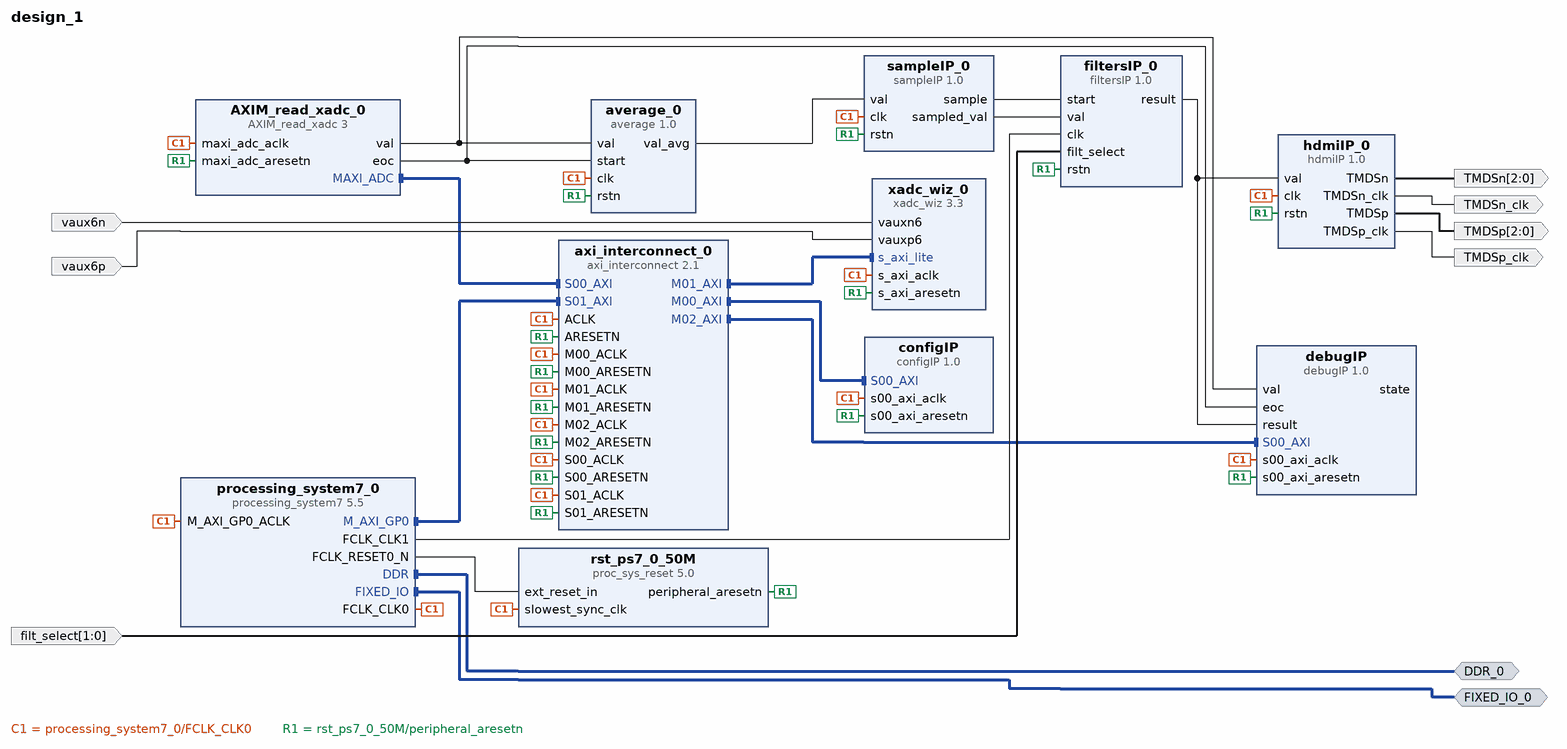
[diagram p0: block diagram of the top level]
# Vivado block design design_1, xc7z010clg400-1, Vivado 2019.2
create_bd_design design_1

create_bd_intf_port -mode Master -vlnv xilinx.com:interface:ddrx_rtl:1.0 DDR_0
create_bd_intf_port -mode Master -vlnv xilinx.com:display_processing_system7:fixedio_rtl:1.0 FIXED_IO_0
create_bd_port -dir I vaux6n
create_bd_port -dir I vaux6p
create_bd_port -dir I -from 1 -to 0 filt_select
create_bd_port -dir O -from 2 -to 0 TMDSn
create_bd_port -dir O -type clk TMDSn_clk
create_bd_port -dir O -from 2 -to 0 TMDSp
create_bd_port -dir O -type clk TMDSp_clk

create_bd_cell -type ip -vlnv xilinx.com:ip:xadc_wiz:3.3 xadc_wiz_0
set_property -dict [list \
  CONFIG.CHANNEL_ENABLE_VP_VN false \
  CONFIG.ENABLE_VCCDDRO_ALARM false \
  CONFIG.ENABLE_VCCPAUX_ALARM false \
  CONFIG.ENABLE_VCCPINT_ALARM false \
  CONFIG.EXTERNAL_MUX_CHANNEL VP_VN \
  CONFIG.OT_ALARM false \
  CONFIG.SEQUENCER_MODE Off \
  CONFIG.SINGLE_CHANNEL_ACQUISITION_TIME false \
  CONFIG.SINGLE_CHANNEL_SELECTION VAUXP6_VAUXN6 \
  CONFIG.USER_TEMP_ALARM false \
  CONFIG.VCCAUX_ALARM false \
  CONFIG.VCCINT_ALARM false \
  CONFIG.WAVEFORM_TYPE CONSTANT \
  CONFIG.XADC_STARUP_SELECTION single_channel \
] [get_bd_cells xadc_wiz_0]
create_bd_cell -type ip -vlnv xilinx.com:ip:axi_interconnect:2.1 axi_interconnect_0
set_property -dict {CONFIG.NUM_MI 3 CONFIG.NUM_SI 2} [get_bd_cells axi_interconnect_0]
create_bd_cell -type ip -vlnv xilinx.com:ip:proc_sys_reset:5.0 rst_ps7_0_50M
create_bd_cell -type ip -vlnv xilinx.com:ip:processing_system7:5.5 processing_system7_0
set_property -dict [list \
  CONFIG.PCW_APU_PERIPHERAL_FREQMHZ 667 \
  CONFIG.PCW_ENET0_ENET0_IO {MIO 16 .. 27} \
  CONFIG.PCW_ENET0_GRP_MDIO_ENABLE 1 \
  CONFIG.PCW_ENET0_GRP_MDIO_IO {MIO 52 .. 53} \
  CONFIG.PCW_ENET0_PERIPHERAL_ENABLE 1 \
  CONFIG.PCW_ENET0_RESET_ENABLE 0 \
  CONFIG.PCW_ENET_RESET_ENABLE 1 \
  CONFIG.PCW_ENET_RESET_SELECT {Share reset pin} \
  CONFIG.PCW_EN_CLK1_PORT 1 \
  CONFIG.PCW_FCLK_CLK1_BUF TRUE \
  CONFIG.PCW_FPGA1_PERIPHERAL_FREQMHZ 100 \
  CONFIG.PCW_FPGA_FCLK1_ENABLE 1 \
  CONFIG.PCW_GPIO_MIO_GPIO_ENABLE 1 \
  CONFIG.PCW_GPIO_MIO_GPIO_IO MIO \
  CONFIG.PCW_I2C_RESET_ENABLE 0 \
  CONFIG.PCW_PRESET_BANK1_VOLTAGE {LVCMOS 1.8V} \
  CONFIG.PCW_QSPI_GRP_FBCLK_ENABLE 1 \
  CONFIG.PCW_QSPI_GRP_FBCLK_IO {MIO 8} \
  CONFIG.PCW_QSPI_GRP_SINGLE_SS_ENABLE 1 \
  CONFIG.PCW_QSPI_GRP_SINGLE_SS_IO {MIO 1 .. 6} \
  CONFIG.PCW_QSPI_PERIPHERAL_ENABLE 1 \
  CONFIG.PCW_QSPI_QSPI_IO {MIO 1 .. 6} \
  CONFIG.PCW_SD0_GRP_CD_ENABLE 1 \
  CONFIG.PCW_SD0_GRP_CD_IO {MIO 47} \
  CONFIG.PCW_SD0_GRP_WP_ENABLE 0 \
  CONFIG.PCW_SD0_PERIPHERAL_ENABLE 1 \
  CONFIG.PCW_SD0_SD0_IO {MIO 40 .. 45} \
  CONFIG.PCW_SDIO_PERIPHERAL_FREQMHZ 50 \
  CONFIG.PCW_SINGLE_QSPI_DATA_MODE x4 \
  CONFIG.PCW_UART1_PERIPHERAL_ENABLE 1 \
  CONFIG.PCW_UART1_UART1_IO {MIO 48 .. 49} \
  CONFIG.PCW_UART_PERIPHERAL_FREQMHZ 100 \
  CONFIG.PCW_UIPARAM_DDR_FREQ_MHZ 533.333333 \
  CONFIG.PCW_UIPARAM_DDR_MEMORY_TYPE {DDR 3 (Low Voltage)} \
  CONFIG.PCW_UIPARAM_DDR_PARTNO {MT41K256M16 RE-125} \
  CONFIG.PCW_USB0_PERIPHERAL_ENABLE 1 \
  CONFIG.PCW_USB0_RESET_ENABLE 1 \
  CONFIG.PCW_USB0_RESET_IO {MIO 46} \
  CONFIG.PCW_USB0_USB0_IO {MIO 28 .. 39} \
  CONFIG.PCW_USB_RESET_ENABLE 1 \
  CONFIG.PCW_USB_RESET_SELECT {Share reset pin} \
] [get_bd_cells processing_system7_0]
# 296 more settings of processing_system7_0 are not shown: defaults, MIO pin electricals, DDR timing, and values the tool derives
create_bd_cell -type ip -vlnv user.org:user:debugIP:1.0 debugIP
create_bd_cell -type ip -vlnv user.org:user:AXIM_read_xadc:3 AXIM_read_xadc_0
set_property -dict {CONFIG.DEBUG_PARAM 0} [get_bd_cells AXIM_read_xadc_0]
create_bd_cell -type ip -vlnv user.org:user:configIP:1.0 configIP
set_property -dict {CONFIG.DEBUG_PARAM 0} [get_bd_cells configIP]
create_bd_cell -type ip -vlnv user.org:user:average:1.0 average_0
create_bd_cell -type ip -vlnv user.org:user:hdmiIP:1.0 hdmiIP_0
create_bd_cell -type ip -vlnv user.org:user:sampleIP:1.0 sampleIP_0
create_bd_cell -type ip -vlnv user.org:user:filtersIP:1.0 filtersIP_0
set_property -dict {CONFIG.M 23 CONFIG.XANT_ADDR_SIZE 5 CONFIG.XCOEF_ADDR_SIZE 5} [get_bd_cells filtersIP_0]

# ---- connections ----

connect_bd_intf_net [get_bd_intf_pins processing_system7_0/M_AXI_GP0] [get_bd_intf_pins axi_interconnect_0/S01_AXI]
connect_bd_intf_net [get_bd_intf_pins xadc_wiz_0/s_axi_lite] [get_bd_intf_pins axi_interconnect_0/M01_AXI]
connect_bd_intf_net [get_bd_intf_pins configIP/S00_AXI] [get_bd_intf_pins axi_interconnect_0/M00_AXI]
connect_bd_intf_net [get_bd_intf_pins AXIM_read_xadc_0/MAXI_ADC] [get_bd_intf_pins axi_interconnect_0/S00_AXI]
connect_bd_intf_net [get_bd_intf_pins debugIP/S00_AXI] [get_bd_intf_pins axi_interconnect_0/M02_AXI]
connect_bd_intf_net [get_bd_intf_ports DDR_0] [get_bd_intf_pins processing_system7_0/DDR]
connect_bd_intf_net [get_bd_intf_ports FIXED_IO_0] [get_bd_intf_pins processing_system7_0/FIXED_IO]
connect_bd_net -net vauxn6_1 [get_bd_ports vaux6n] [get_bd_pins xadc_wiz_0/vauxn6]
connect_bd_net -net vauxp6_1 [get_bd_ports vaux6p] [get_bd_pins xadc_wiz_0/vauxp6]
connect_bd_net [get_bd_pins AXIM_read_xadc_0/val] [get_bd_pins debugIP/val] [get_bd_pins average_0/val]
connect_bd_net -net clk_wiz_0_clk [get_bd_pins processing_system7_0/FCLK_CLK0] \
  [get_bd_pins axi_interconnect_0/ACLK] [get_bd_pins axi_interconnect_0/S00_ACLK] [get_bd_pins axi_interconnect_0/M00_ACLK] \
  [get_bd_pins axi_interconnect_0/M01_ACLK] [get_bd_pins axi_interconnect_0/S01_ACLK] \
  [get_bd_pins axi_interconnect_0/M02_ACLK] [get_bd_pins xadc_wiz_0/s_axi_aclk] \
  [get_bd_pins processing_system7_0/M_AXI_GP0_ACLK] [get_bd_pins rst_ps7_0_50M/slowest_sync_clk] \
  [get_bd_pins debugIP/s00_axi_aclk] [get_bd_pins AXIM_read_xadc_0/maxi_adc_aclk] [get_bd_pins configIP/s00_axi_aclk] \
  [get_bd_pins average_0/clk] [get_bd_pins hdmiIP_0/clk] [get_bd_pins sampleIP_0/clk]
connect_bd_net [get_bd_pins rst_ps7_0_50M/peripheral_aresetn] \
  [get_bd_pins xadc_wiz_0/s_axi_aresetn] [get_bd_pins axi_interconnect_0/M02_ARESETN] \
  [get_bd_pins axi_interconnect_0/S01_ARESETN] [get_bd_pins axi_interconnect_0/M01_ARESETN] \
  [get_bd_pins axi_interconnect_0/M00_ARESETN] [get_bd_pins axi_interconnect_0/S00_ARESETN] \
  [get_bd_pins axi_interconnect_0/ARESETN] [get_bd_pins debugIP/s00_axi_aresetn] \
  [get_bd_pins AXIM_read_xadc_0/maxi_adc_aresetn] [get_bd_pins configIP/s00_axi_aresetn] [get_bd_pins average_0/rstn] \
  [get_bd_pins hdmiIP_0/rstn] [get_bd_pins sampleIP_0/rstn] [get_bd_pins filtersIP_0/rstn]
connect_bd_net [get_bd_pins AXIM_read_xadc_0/eoc] [get_bd_pins debugIP/eoc] [get_bd_pins average_0/start]
# net AXIM_read_xadc_0_mst_exec_state has one end: debugIP/state
connect_bd_net [get_bd_ports filt_select] [get_bd_pins filtersIP_0/filt_select]
connect_bd_net [get_bd_pins processing_system7_0/FCLK_RESET0_N] [get_bd_pins rst_ps7_0_50M/ext_reset_in]
connect_bd_net [get_bd_pins processing_system7_0/FCLK_CLK1] [get_bd_pins filtersIP_0/clk]
connect_bd_net [get_bd_pins hdmiIP_0/TMDSn] [get_bd_ports TMDSn]
connect_bd_net [get_bd_pins hdmiIP_0/TMDSn_clk] [get_bd_ports TMDSn_clk]
connect_bd_net [get_bd_pins hdmiIP_0/TMDSp] [get_bd_ports TMDSp]
connect_bd_net [get_bd_pins hdmiIP_0/TMDSp_clk] [get_bd_ports TMDSp_clk]
connect_bd_net [get_bd_pins filtersIP_0/result] [get_bd_pins debugIP/result] [get_bd_pins hdmiIP_0/val]
connect_bd_net [get_bd_pins average_0/val_avg] [get_bd_pins sampleIP_0/val]
connect_bd_net [get_bd_pins sampleIP_0/sample] [get_bd_pins filtersIP_0/start]
connect_bd_net [get_bd_pins sampleIP_0/sampled_val] [get_bd_pins filtersIP_0/val]

# ---- address map ----
assign_bd_address -offset 0x43C00000 -range 64K -target_address_space [get_bd_addr_spaces AXIM_read_xadc_0/MAXI_ADC] [get_bd_addr_segs xadc_wiz_0/s_axi_lite/Reg]
assign_bd_address -offset 0x43C10000 -range 64K -target_address_space [get_bd_addr_spaces AXIM_read_xadc_0/MAXI_ADC] [get_bd_addr_segs configIP/S00_AXI/S00_AXI_reg]
assign_bd_address -offset 0x43C20000 -range 64K -target_address_space [get_bd_addr_spaces AXIM_read_xadc_0/MAXI_ADC] [get_bd_addr_segs debugIP/S00_AXI/S00_AXI_reg]
assign_bd_address -offset 0x43C00000 -range 64K -target_address_space [get_bd_addr_spaces processing_system7_0/Data] [get_bd_addr_segs xadc_wiz_0/s_axi_lite/Reg]
assign_bd_address -offset 0x43C10000 -range 64K -target_address_space [get_bd_addr_spaces processing_system7_0/Data] [get_bd_addr_segs configIP/S00_AXI/S00_AXI_reg]
assign_bd_address -offset 0x43C20000 -range 64K -target_address_space [get_bd_addr_spaces processing_system7_0/Data] [get_bd_addr_segs debugIP/S00_AXI/S00_AXI_reg]

validate_bd_design
save_bd_design
